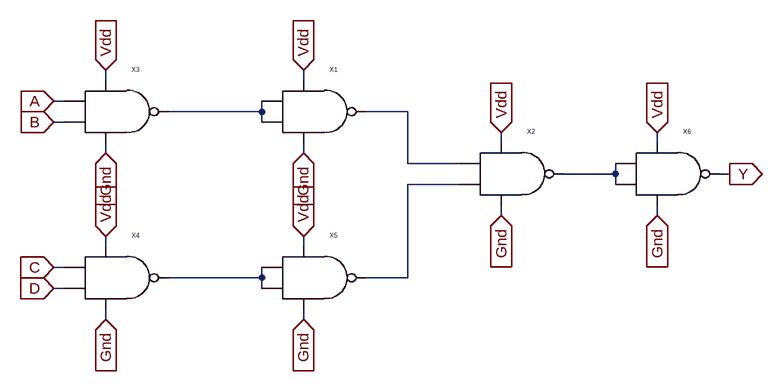
[diagram p0: schematic 4and.asc]
4and.asc, the LTspice schematic file:
Version 4
SHEET 1 880 680
WIRE -368 -48 -368 -64
WIRE -64 -48 -64 -64
WIRE -432 -16 -448 -16
WIRE -128 0 -128 -16
WIRE -128 0 -272 0
WIRE 96 0 32 0
WIRE -432 16 -448 16
WIRE -128 16 -128 0
WIRE 240 48 240 32
WIRE 480 48 480 32
WIRE -368 64 -368 48
WIRE -64 64 -64 48
WIRE 96 80 96 0
WIRE 176 80 96 80
WIRE 416 96 416 80
WIRE 416 96 336 96
WIRE 592 96 576 96
WIRE 176 112 96 112
WIRE 416 112 416 96
WIRE 240 160 240 144
WIRE 480 160 480 144
WIRE -368 208 -368 192
WIRE -64 208 -64 192
WIRE -432 240 -448 240
WIRE -128 256 -128 240
WIRE -128 256 -272 256
WIRE 96 256 96 112
WIRE 96 256 32 256
WIRE -432 272 -448 272
WIRE -128 272 -128 256
WIRE -368 320 -368 304
WIRE -64 320 -64 304
FLAG -368 -64 Vdd
IOPIN -368 -64 In
FLAG -64 -64 Vdd
IOPIN -64 -64 In
FLAG -368 192 Vdd
IOPIN -368 192 In
FLAG -64 192 Vdd
IOPIN -64 192 In
FLAG 240 32 Vdd
IOPIN 240 32 In
FLAG -448 -16 A
IOPIN -448 -16 In
FLAG -448 16 B
IOPIN -448 16 In
FLAG -448 240 C
IOPIN -448 240 In
FLAG -448 272 D
IOPIN -448 272 In
FLAG -64 64 Gnd
IOPIN -64 64 In
FLAG -368 64 Gnd
IOPIN -368 64 In
FLAG -368 320 Gnd
IOPIN -368 320 In
FLAG -64 320 Gnd
IOPIN -64 320 In
FLAG 240 160 Gnd
IOPIN 240 160 In
FLAG 480 32 Vdd
IOPIN 480 32 In
FLAG 480 160 Gnd
IOPIN 480 160 In
FLAG 592 96 Y
IOPIN 592 96 Out
SYMBOL nand -64 0 R0
SYMATTR InstName X1
SYMBOL nand 240 96 R0
SYMATTR InstName X2
SYMBOL nand -368 0 R0
SYMATTR InstName X3
SYMBOL nand -368 256 R0
SYMATTR InstName X4
SYMBOL nand -64 256 R0
SYMATTR InstName X5
SYMBOL nand 480 96 R0
SYMATTR InstName X6

The netlist it stands for:
* 4and.asc
XX1 N001 N001 Vdd Gnd N002 nand  ; pins A B vdd gnd Y
XX2 N002 N004 Vdd Gnd N003 nand  ; pins A B vdd gnd Y
XX3 A B Vdd Gnd N001 nand  ; pins A B vdd gnd Y
XX4 C D Vdd Gnd N005 nand  ; pins A B vdd gnd Y
XX5 N005 N005 Vdd Gnd N004 nand  ; pins A B vdd gnd Y
XX6 N003 N003 Vdd Gnd Y nand  ; pins A B vdd gnd Y
.backanno
.end